# EAGLE design headstage-adapter (EAGLE 6.5.0)
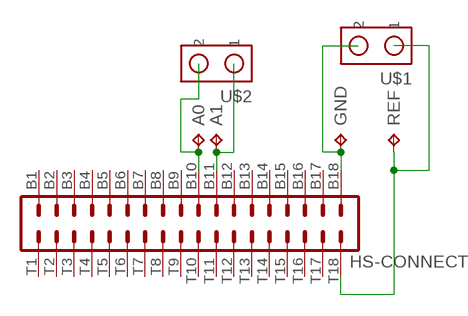
[diagram p0: schematic, sheet 1]

## Parts
A0  220-S02-100  TP_AMPHENOL-220  [AMPHENOL-220]
A1  220-S02-100  TP_AMPHENOL-220  [AMPHENOL-220]
GND  220-S02-100  TP_AMPHENOL-220  [AMPHENOL-220]
HS-CONNECT  NPD-AA-36  OMNETICS_A79024_NPD-AA  [OMNETICS_NPD-AA-36-GS]
REF  220-S02-100  TP_AMPHENOL-220  [AMPHENOL-220]
U$1  SCREW2  [SCREW2]
U$2  SCREW2  [SCREW2]

## Nets
GND: GND.TP HS-CONNECT.B18 U$1.P$2
N$1: A0.TP HS-CONNECT.B10 U$2.P$2
N$2: A1.TP HS-CONNECT.B11 U$2.P$1
N$6: HS-CONNECT.T18 REF.TP U$1.P$1
Unconnected: HS-CONNECT.B1 HS-CONNECT.B2 HS-CONNECT.B3 HS-CONNECT.B4 HS-CONNECT.B5 HS-CONNECT.B6 HS-CONNECT.B7 HS-CONNECT.B8 HS-CONNECT.B9 HS-CONNECT.B12 HS-CONNECT.B13 HS-CONNECT.B14 HS-CONNECT.B15 HS-CONNECT.B16 HS-CONNECT.B17 HS-CONNECT.T1 HS-CONNECT.T2 HS-CONNECT.T3 HS-CONNECT.T4 HS-CONNECT.T5 HS-CONNECT.T6 HS-CONNECT.T7 HS-CONNECT.T8 HS-CONNECT.T9 HS-CONNECT.T10 HS-CONNECT.T11 HS-CONNECT.T12 HS-CONNECT.T13 HS-CONNECT.T14 HS-CONNECT.T15 HS-CONNECT.T16 HS-CONNECT.T17

## Library data of the parts
A0 A1 GND REF = jonnew:TP: Test pad
HS-CONNECT = jonnew:OMNETICS_A79024: Omnetics A79024 36-pin connector
U$1 U$2 = jonnew:SCREW2: Screw Terminal

## Board
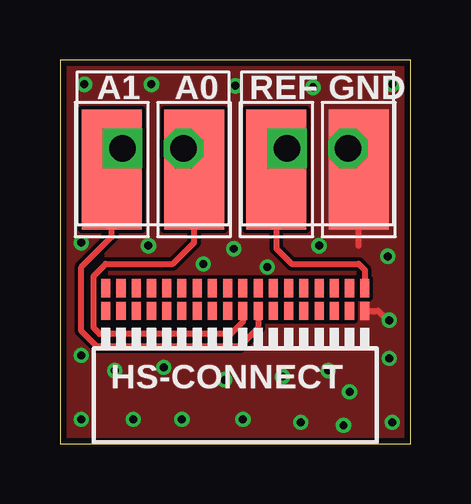
[diagram p1: board, top side]
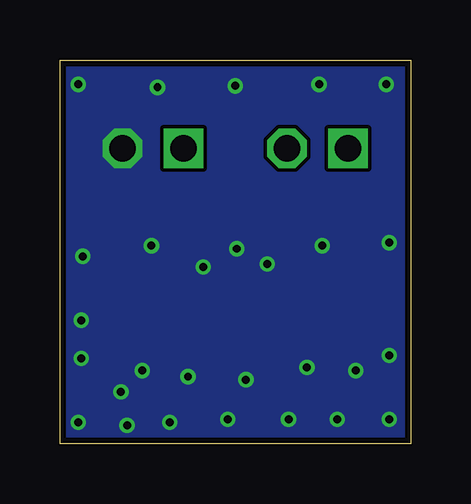
[diagram p2: board, bottom side, seen from below]

Size 14.61 x 16 mm. Coordinates in mm from the lower left corner, seen from the top.
Outline: 0,0 14.61,0 14.61,16 0,16 0,0
Copper layers (1*16): Top 0.035mm / dielectric 1.5mm / Bottom 0.035mm
Design rules "seeed-studio-2-layer": minimum track width 6mil, minimum drill 12mil, track to track 6mil, track to pad 6mil, pad to pad 6mil, via to via 6mil, smd to smd 0mil, copper to edge 10mil, drill to drill 10mil, minimum pad ring 10mil, minimum via ring 6mil, stop-mask expansion 2mil, vias tented up to drill 100mil, thermal gap 10mil

### Footprints (pad centres in the part's own frame; a part is rotated, then mirrored left to right if it is on the bottom)
AMPHENOL-220 = smd 2.5 x 5: TP 0,0
OMNETICS_NPD-AA-36-GS = smd 0.381 x 0.762: B1 -5.397,-0.559; B2 -4.763,-0.559; B3 -4.128,-0.559; B4 -3.493,-0.559; B5 -2.857,-0.559; B6 -2.223,-0.559; B7 -1.587,-0.559; B8 -0.953,-0.559; B9 -0.318,-0.559; B10 0.318,-0.559; B11 0.953,-0.559; B12 1.587,-0.559; B13 2.223,-0.559; B14 2.857,-0.559; B15 3.493,-0.559; B16 4.128,-0.559; B17 4.763,-0.559; B18 5.397,-0.559; T1 -5.397,0.381; T2 -4.763,0.381; T3 -4.128,0.381; T4 -3.493,0.381; T5 -2.857,0.381; T6 -2.223,0.381; T7 -1.587,0.381; T8 -0.953,0.381; T9 -0.318,0.381; T10 1.587,0.381; T11 0.953,0.381; T12 0.318,0.381; T13 2.223,0.381; T14 2.857,0.381; T15 3.493,0.381; T16 4.128,0.381; T17 4.763,0.381; T18 5.397,0.381
SCREW2 = drill 1.1 square: P$1 0,0 | drill 1.1 octagon: P$2 2.54,0

### Placement (x,y rotation side)
A0  5.59,11.43 0 top
A1  2.16,11.43 0 top
GND  12.45,11.43 0 top
HS-CONNECT  7.3,6.1 0 top
REF  9.02,11.43 0 top
U$1  9.46,12.32 0 top
U$2  2.6,12.32 0 top

### Tracks (layer width: path | path; a pad name or v marks a point on that pad's centre or on a via)
GND  (via drill 0.33)
  Top 0.254: 12.45,8.26 GND.TP 12,11.87 U$1.P$2 | HS-CONNECT.B18 13.26,5.54 13.46,5.33
  other vias: 0.89,1.02 0.89,3.68 5.08,1.02 4.32,3.17 6.86,2.67 3.05,1.02 2.29,3.05 10.03,0.89 11.18,3.05 12.06,2.16 11.81,0.76 13.84,0.89 13.72,3.56 7.62,1.02 9.27,2.79 7.24,8.13 5.97,7.49 8.64,7.37 0.89,8.38 1.02,14.99 3.81,14.99 7.3,14.92 10.54,14.86 13.84,14.99 13.72,5.14 10.79,8.26 3.68,8.26 13.65,7.81
  pour Bottom (no thermals): -0.13,11.94 -0.13,16.13 14.73,16.13 14.73,-0.13 -0.13,-0.13
  pour Top (no thermals): -0.13,11.94 -0.13,16.13 14.73,16.13 14.73,-0.13 -0.13,-0.13
N$1
  Top 0.254: HS-CONNECT.B10 7.62,5.08 7.11,4.57 1.65,4.57 1.4,4.83 1.4,6.99 1.91,7.49 4.7,7.49 5.59,8.38 A0.TP 5.14,11.87 U$2.P$2
N$2
  Top 0.254: HS-CONNECT.B11 8.26,4.83 7.49,4.06 1.52,4.06 0.89,4.7 0.89,7.37 2.16,8.64 A1.TP 2.6,11.87 U$2.P$1
N$6
  Top 0.254: HS-CONNECT.T18 12.7,7.24 12.45,7.49 9.65,7.49 9.02,8.13 REF.TP 9.46,11.87 U$1.P$1